# EAGLE design lp_port_tester (EAGLE 6.5.0)
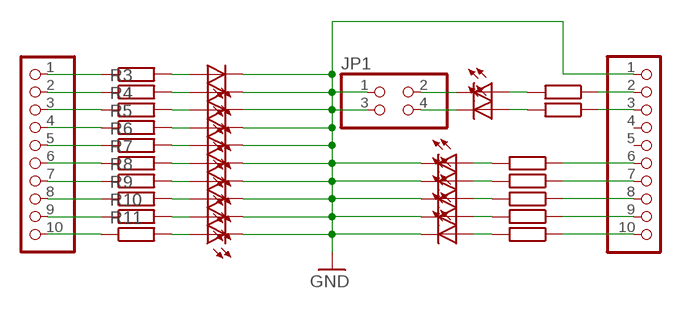
[diagram p0: schematic, sheet 1]

## Parts
J1  J1  PINHD-1X10  [1X10]
J2  J2  PINHD-1X10  [1X10]
JP1  PINHD-2X2  [2X02]
PWR  PWR  LEDCHIPLED_1206  [CHIPLED_1206]
PWR1  PWR  LEDCHIPLED_1206  [CHIPLED_1206]
PWR2  PWR  LEDCHIPLED_1206  [CHIPLED_1206]
PWR3  PWR  LEDCHIPLED_1206  [CHIPLED_1206]
PWR4  PWR  LEDCHIPLED_1206  [CHIPLED_1206]
PWR5  PWR  LEDCHIPLED_1206  [CHIPLED_1206]
PWR6  PWR  LEDCHIPLED_1206  [CHIPLED_1206]
PWR7  PWR  LEDCHIPLED_1206  [CHIPLED_1206]
PWR8  PWR  LEDCHIPLED_1206  [CHIPLED_1206]
PWR9  PWR  LEDCHIPLED_1206  [CHIPLED_1206]
PWR10  PWR  LEDCHIPLED_1206  [CHIPLED_1206]
PWR11  PWR  LEDCHIPLED_1206  [CHIPLED_1206]
PWR14  PWR  LEDCHIPLED_1206  [CHIPLED_1206]
PWR15  PWR  LEDCHIPLED_1206  [CHIPLED_1206]
PWR16  PWR  LEDCHIPLED_1206  [CHIPLED_1206]
PWR17  PWR  LEDCHIPLED_1206  [CHIPLED_1206]
PWR18  PWR  LEDCHIPLED_1206  [CHIPLED_1206]
R1  470  R-EU_R0805  [R0805]
R2  470  R-EU_R0805  [R0805]
R3  470  R-EU_R0805  [R0805]
R4  470  R-EU_R0805  [R0805]
R5  470  R-EU_R0805  [R0805]
R6  470  R-EU_R0805  [R0805]
R7  470  R-EU_R0805  [R0805]
R8  470  R-EU_R0805  [R0805]
R9  470  R-EU_R0805  [R0805]
R10  470  R-EU_R0805  [R0805]
R11  470  R-EU_R0805  [R0805]
R12  470  R-EU_R0805  [R0805]
R15  470  R-EU_R0805  [R0805]
R16  470  R-EU_R0805  [R0805]
R17  470  R-EU_R0805  [R0805]
R18  470  R-EU_R0805  [R0805]
R19  470  R-EU_R0805  [R0805]

## Nets
GND [GND]: J2.1 JP1.1 JP1.3 PWR1.C PWR2.C PWR3.C PWR4.C PWR5.C PWR6.C PWR7.C PWR8.C PWR9.C PWR10.C PWR14.C PWR15.C PWR16.C PWR17.C PWR18.C
N$1: PWR1.A R1.2
N$2: PWR.A R2.2
N$3: PWR2.A R3.2
N$4: PWR3.A R4.2
N$5: PWR4.A R5.2
N$6: PWR5.A R6.2
N$7: PWR6.A R7.2
N$8: PWR7.A R8.2
N$9: PWR8.A R9.2
N$10: PWR9.A R10.2
N$11: PWR10.A R11.2
N$12: PWR11.A R12.2
N$13: J1.4 R5.1
N$14: J1.5 R6.1
N$15: PWR14.A R15.2
N$17: PWR15.A R16.2
N$18: PWR16.A R17.2
N$19: PWR17.A R18.2
N$20: PWR18.A R19.2
N$21: J1.1 R1.1
N$22: J1.2 R3.1
N$23: J2.2 R2.1
N$24: J2.3 R12.1
N$25: J1.9 R10.1
N$26: J1.10 R11.1
N$27: J1.3 R4.1
N$28: J1.8 R9.1
N$29: J2.6 R15.1
N$30: J2.7 R16.1
N$31: J2.8 R17.1
N$32: J2.9 R18.1
N$33: J2.10 R19.1
N$34: J1.7 R8.1
N$35: J1.6 R7.1
N$36: JP1.2 PWR.C
N$37: JP1.4 PWR11.C
Unconnected: J2.4 J2.5

## Library data of the parts
J1 J2 = pinhead:PINHD-1X10: PIN HEADER
JP1 = pinhead:PINHD-2X2: PIN HEADER
PWR PWR1-PWR11 PWR14-PWR18 = led:LED: LED OSRAM: - CHIPLED LG R971, LG N971, LY N971, LG Q971, LY Q971, LO R971, LY R971 LH N974, LH R974 LS Q976, LO Q976, LY Q976 LO Q996 - Hyper CHIPLED LW Q18S LB Q993, LB Q99A, LB R99A - SideLED LS A670, LO A670, LY A670, LG A670, LP A670 LB A673, LV A673, LT A673, LW A673 LH A674 LY A675 LS A676, LA A676, LO A676, LY A676, LW A676 LS A679, LY A679, LG A679 - Hyper Micro SIDELED® LS Y876, LA Y876, LO Y876, LY Y876 LT Y87S - SmartLED LW L88C, LW L88S LB L89C, LB L89S, LG L890 LS L89K, LO L89K, LY L89K LS L896, LA L896, LO L896, LY L896 - TOPLED LS T670, LO T670, LY T670, LG T670, LP T670 LSG T670, LSP T670, LSY T670, LOP T670, LYG T670 LG T671, LOG T671, LSG T671 LB T673, LV T673, LT T673, LW T673 LH T674 LS T676, LA T676, LO T676, LY T676, LB T676, LH T676, LSB T676, LW T676 LB T67C, LV T67C, LT T67C, LS T67K, LO T67K, LY T67K, LW E67C LS E67B, LA E67B, LO E67B, LY E67B, LB E67C, LV E67C, LT E67C LW T67C LS T679, LY T679, LG T679 LS T770, LO T770, LY T770, LG T770, LP T770 LB T773, LV T773, LT T773, LW T773 LH T774 LS E675, LA E675, LY E675, LS T675 LS T776, LA T776, LO T776, LY T776, LB T776 LHGB T686 LT T68C, LB T68C - Hyper Mini TOPLED® LB M676 - Mini TOPLED Santana® LG M470 LS M47K, LO M47K, LY M47K Source: http://www.osram.convergy.de LUXEON: - LUMILED® LXK2-PW12-R00, LXK2-PW12-S00, LXK2-PW14-U00, LXK2-PW14-V00 LXK2-PM12-R00, LXK2-PM12-S00, LXK2-PM14-U00 LXK2-PE12-Q00, LXK2-PE12-R00, LXK2-PE12-S00, LXK2-PE14-T00, LXK2-PE14-U00 LXK2-PB12-K00, LXK2-PB12-L00, LXK2-PB12-M00, LXK2-PB14-N00, LXK2-PB14-P00, LXK2-PB14-Q00 LXK2-PR12-L00, LXK2-PR12-M00, LXK2-PR14-Q00, LXK2-PR14-R00 LXK2-PD12-Q00, LXK2-PD12-R00, LXK2-PD12-S00 LXK2-PH12-R00, LXK2-PH12-S00 LXK2-PL12-P00, LXK2-PL12-Q00, LXK2-PL12-R00 Source: www.luxeon.com KINGBRIGHT: KA-3528ASYC Source: www.kingbright.com
R1-R12 R15-R19 = resistor:R-EU_: RESISTOR, European symbol

## Net classes
0 default: width 0.508 mm, drill 0.508 mm
1 GND: width 0.813 mm, drill 0.508 mm
2 VCC: width 0.813 mm, drill 0.508 mm

## Board
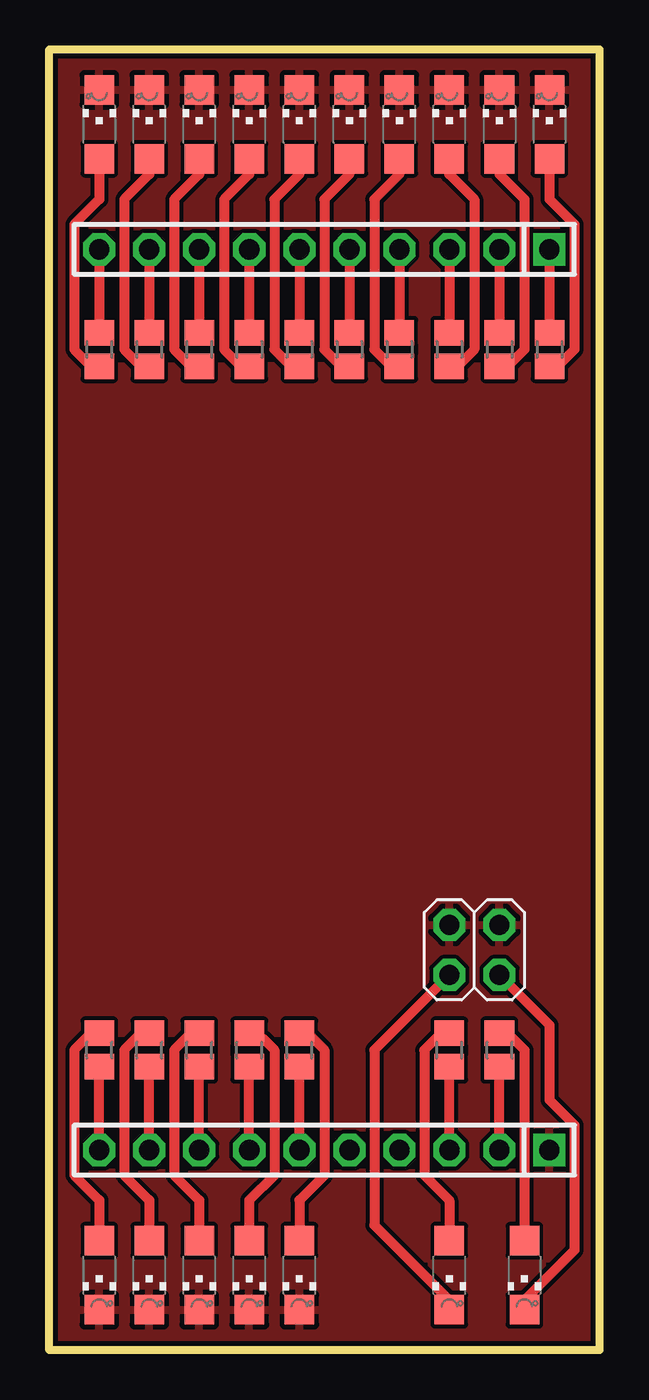
[diagram p1: board, top side]
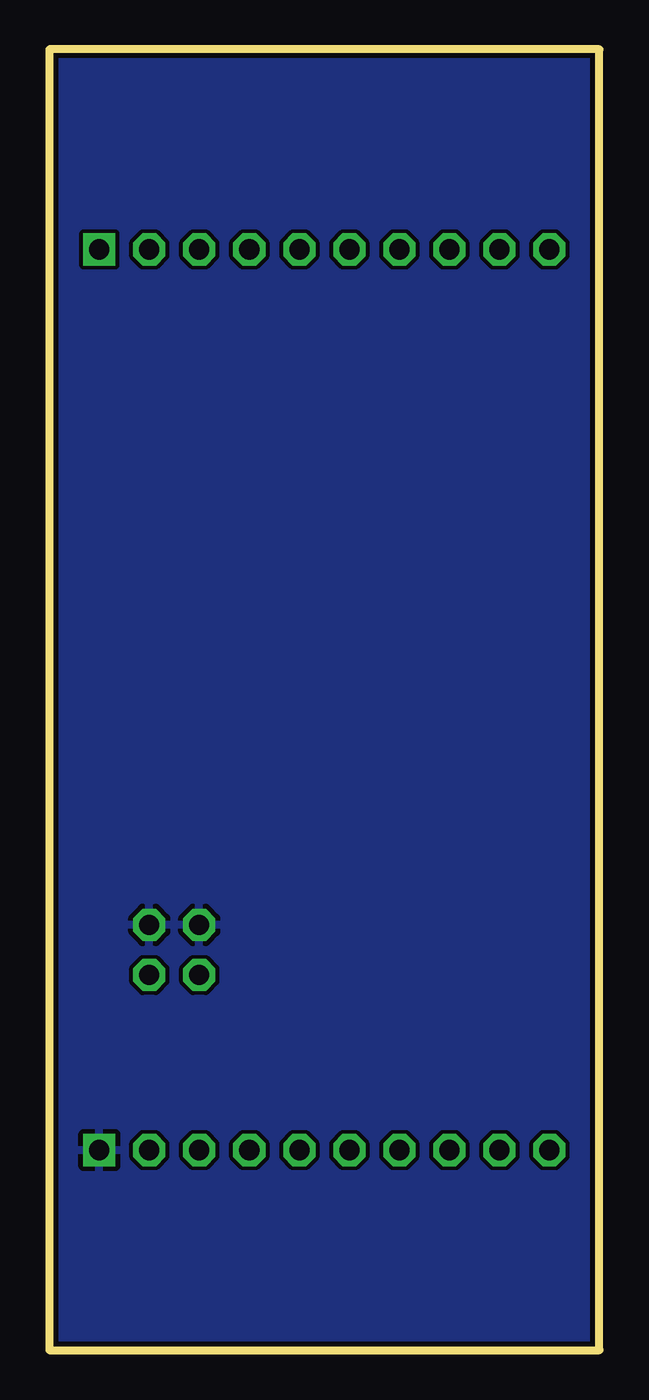
[diagram p2: board, bottom side, seen from below]

Size 27.94 x 66.04 mm. Coordinates in mm from the lower left corner, seen from the top.
Outline: 0,66.04 27.94,66.04 27.94,0 0,0 0,66.04
Copper layers (1*16): Top 0.035mm / dielectric 1.5mm / Bottom 0.035mm
Design rules "SparkFun *": minimum track width 20mil, minimum drill 20mil, track to track 8mil, track to pad 8mil, pad to pad 8mil, via to via 8mil, smd to smd 8mil, copper to edge 10mil, drill to drill 8mil, minimum pad ring 12mil, minimum via ring 10mil, stop-mask expansion 4mil, vias tented up to drill 25mil, thermal gap 10mil

### Footprints (pad centres in the part's own frame; a part is rotated, then mirrored left to right if it is on the bottom)
1X10 = drill 1.016 square: 1 -11.43,0 | drill 1.016 octagon: 2 -8.89,0; 3 -6.35,0; 4 -3.81,0; 5 -1.27,0; 6 1.27,0; 7 3.81,0; 8 6.35,0; 9 8.89,0; 10 11.43,0
2X02 = drill 1.016 octagon: 1 -1.27,-1.27; 2 -1.27,1.27; 3 1.27,-1.27; 4 1.27,1.27
CHIPLED_1206 = smd 1.5 x 1.5: A 0,-1.75; C 0,1.75
R0805 = smd 1.3 x 1.5: 1 -0.85,0; 2 0.85,0

### Placement (x,y rotation side)
J1  13.97,55.88 180 top
J2  13.97,10.16 180 top
JP1  21.59,20.32 180 top
PWR  24.13,3.81 180 top
PWR1  25.4,62.23 0 top
PWR2  22.86,62.23 0 top
PWR3  20.32,62.23 0 top
PWR4  17.78,62.23 0 top
PWR5  15.24,62.23 0 top
PWR6  12.7,62.23 0 top
PWR7  10.16,62.23 0 top
PWR8  7.62,62.23 0 top
PWR9  5.08,62.23 0 top
PWR10  2.54,62.23 0 top
PWR11  20.32,3.81 180 top
PWR14  12.7,3.81 180 top
PWR15  10.16,3.81 180 top
PWR16  7.62,3.81 180 top
PWR17  5.08,3.81 180 top
PWR18  2.54,3.81 180 top
R1  25.4,50.8 270 top
R2  22.86,15.24 90 top
R3  22.86,50.8 270 top
R4  20.32,50.8 270 top
R5  17.78,50.8 270 top
R6  15.24,50.8 270 top
R7  12.7,50.8 270 top
R8  10.16,50.8 270 top
R9  7.62,50.8 270 top
R10  5.08,50.8 270 top
R11  2.54,50.8 270 top
R12  20.32,15.24 90 top
R15  12.7,15.24 90 top
R16  10.16,15.24 90 top
R17  7.62,15.24 90 top
R18  5.08,15.24 90 top
R19  2.54,15.24 90 top

### Tracks (layer width: path | path; a pad name or v marks a point on that pad's centre or on a via)
GND
  pour Bottom: 29.31,-1.07 -1.23,-1.07 -1.23,67.31 29.31,67.41
  pour Top: 29.31,-1.07 -1.27,-1.07 -1.27,67.31 29.31,67.41
N$1
  Top 0.508: R1.2 25.4,49.53 26.67,50.8 26.67,57.15 25.4,58.42 PWR1.A 25.4,60.96
N$2
  Top 0.508: 24.13,5.08 PWR.A 24.13,15.24 22.86,16.51 R2.2
N$3
  Top 0.508: R3.2 22.86,49.53 24.13,50.8 24.13,58.42 22.86,59.69 PWR2.A 22.86,60.96
N$4
  Top 0.508: R4.2 20.32,49.53 21.59,50.8 21.59,58.42 20.32,59.69 PWR3.A 20.32,60.96
N$5
  Top 0.508: R5.2 17.78,49.53 16.51,50.8 16.51,58.42 17.78,59.69 PWR4.A 17.78,60.96
N$6
  Top 0.508: R6.2 15.24,49.53 13.97,50.8 13.97,58.42 15.24,59.69 PWR5.A 15.24,60.96
N$7
  Top 0.508: R7.2 12.7,49.53 11.43,50.8 11.43,58.42 12.7,59.69 PWR6.A 12.7,60.96
N$8
  Top 0.508: R8.2 10.16,49.53 8.89,50.8 8.89,58.42 10.16,59.69 PWR7.A 10.16,60.96
N$9
  Top 0.508: R9.2 7.62,49.53 6.35,50.8 6.35,58.42 7.62,59.69 PWR8.A 7.62,60.96
N$10
  Top 0.508: R10.2 5.08,49.53 3.81,50.8 3.81,58.42 5.08,59.69 PWR9.A 5.08,60.96
N$11
  Top 0.508: R11.2 2.54,49.53 1.27,50.8 1.27,57.15 2.54,58.42 PWR10.A 2.54,60.96
N$12
  Top 0.508: 20.32,5.08 PWR11.A 20.32,7.62 19.05,8.89 19.05,15.24 20.32,16.51 R12.2
N$13
  Top 0.508: J1.4 R5.1
N$14
  Top 0.508: J1.5 R6.1
N$15
  Top 0.508: 12.7,5.08 PWR14.A 12.7,7.62 13.97,8.89 13.97,15.24 12.7,16.51 R15.2
N$17
  Top 0.508: 10.16,5.08 PWR15.A 10.16,7.62 11.43,8.89 11.43,15.24 10.16,16.51 R16.2
N$18
  Top 0.508: 7.62,5.08 PWR16.A 7.62,7.62 6.35,8.89 6.35,15.24 7.62,16.51 R17.2
N$19
  Top 0.508: 5.08,5.08 PWR17.A 5.08,7.62 3.81,8.89 3.81,15.24 5.08,16.51 R18.2
N$20
  Top 0.508: 2.54,5.08 PWR18.A 2.54,7.62 1.27,8.89 1.27,15.24 2.54,16.51 R19.2
N$21
  Top 0.508: J1.1 R1.1
N$22
  Top 0.508: J1.2 R3.1
N$23
  Top 0.508: J2.2 R2.1
N$24
  Top 0.508: J2.3 R12.1
N$25
  Top 0.508: J1.9 R10.1
N$26
  Top 0.508: J1.10 R11.1
N$27
  Top 0.508: J1.3 R4.1
N$28
  Top 0.508: J1.8 R9.1
N$29
  Top 0.508: J2.6 R15.1
N$30
  Top 0.508: J2.7 R16.1
N$31
  Top 0.508: J2.8 R17.1
N$32
  Top 0.508: J2.9 R18.1
N$33
  Top 0.508: J2.10 R19.1
N$34
  Top 0.508: J1.7 R8.1
N$35
  Top 0.508: J1.6 R7.1
N$36
  Top 0.508: JP1.2 25.4,16.51 25.4,12.7 26.67,11.43 26.67,5.08 24.13,2.54 PWR.C
N$37
  Top 0.508: JP1.4 16.51,15.24 16.51,6.35 20.32,2.54 PWR11.C